# EAGLE design host_1 (EAGLE 9.3.1)
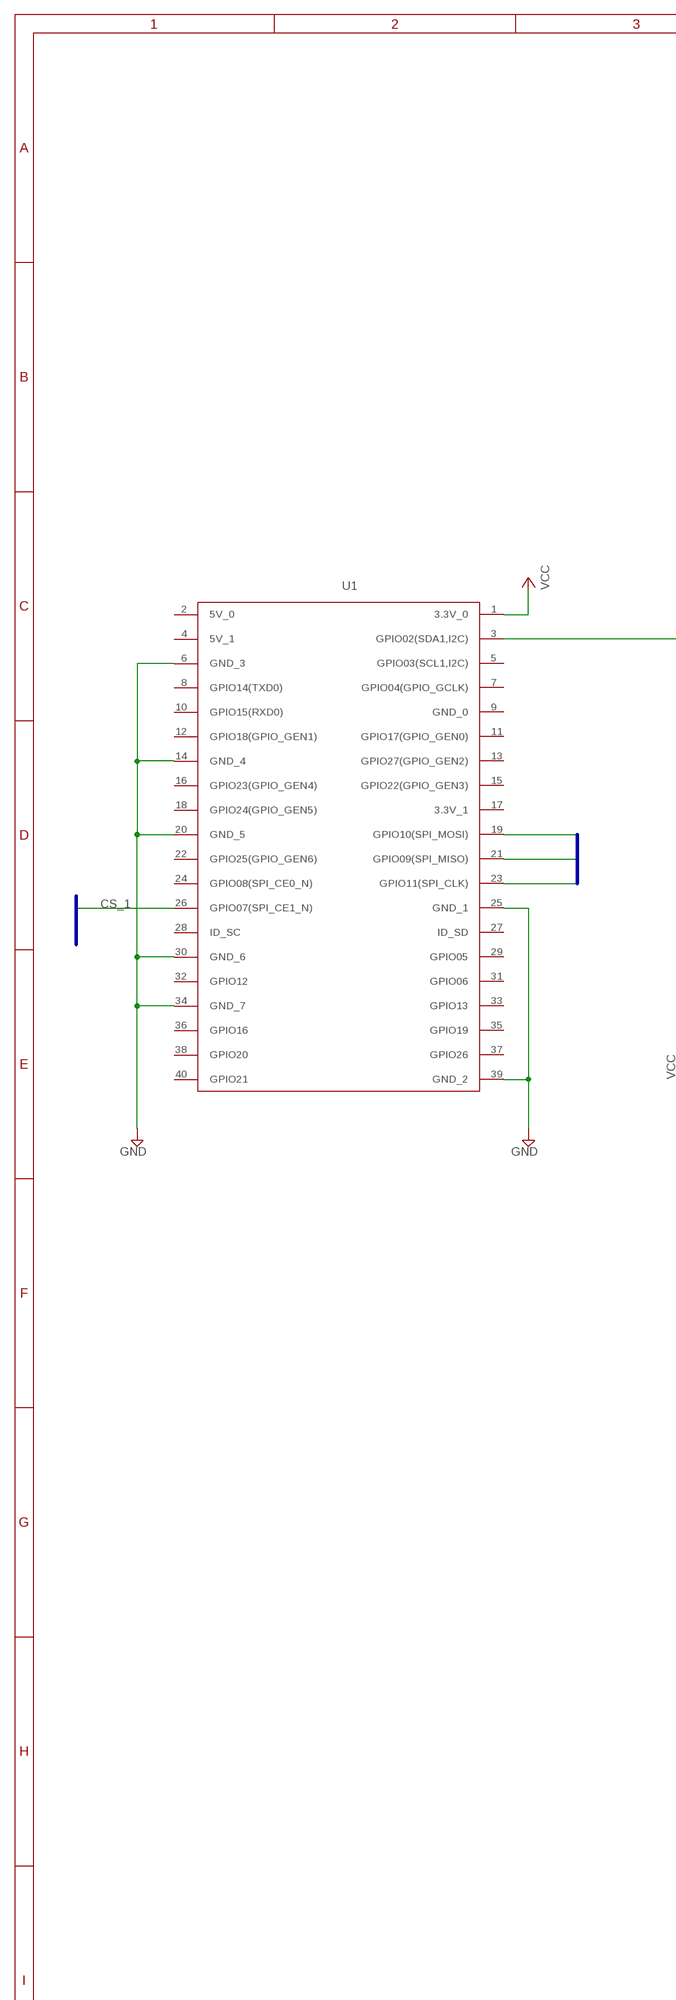
[diagram p0: schematic, sheet 1, part 1 of 2]
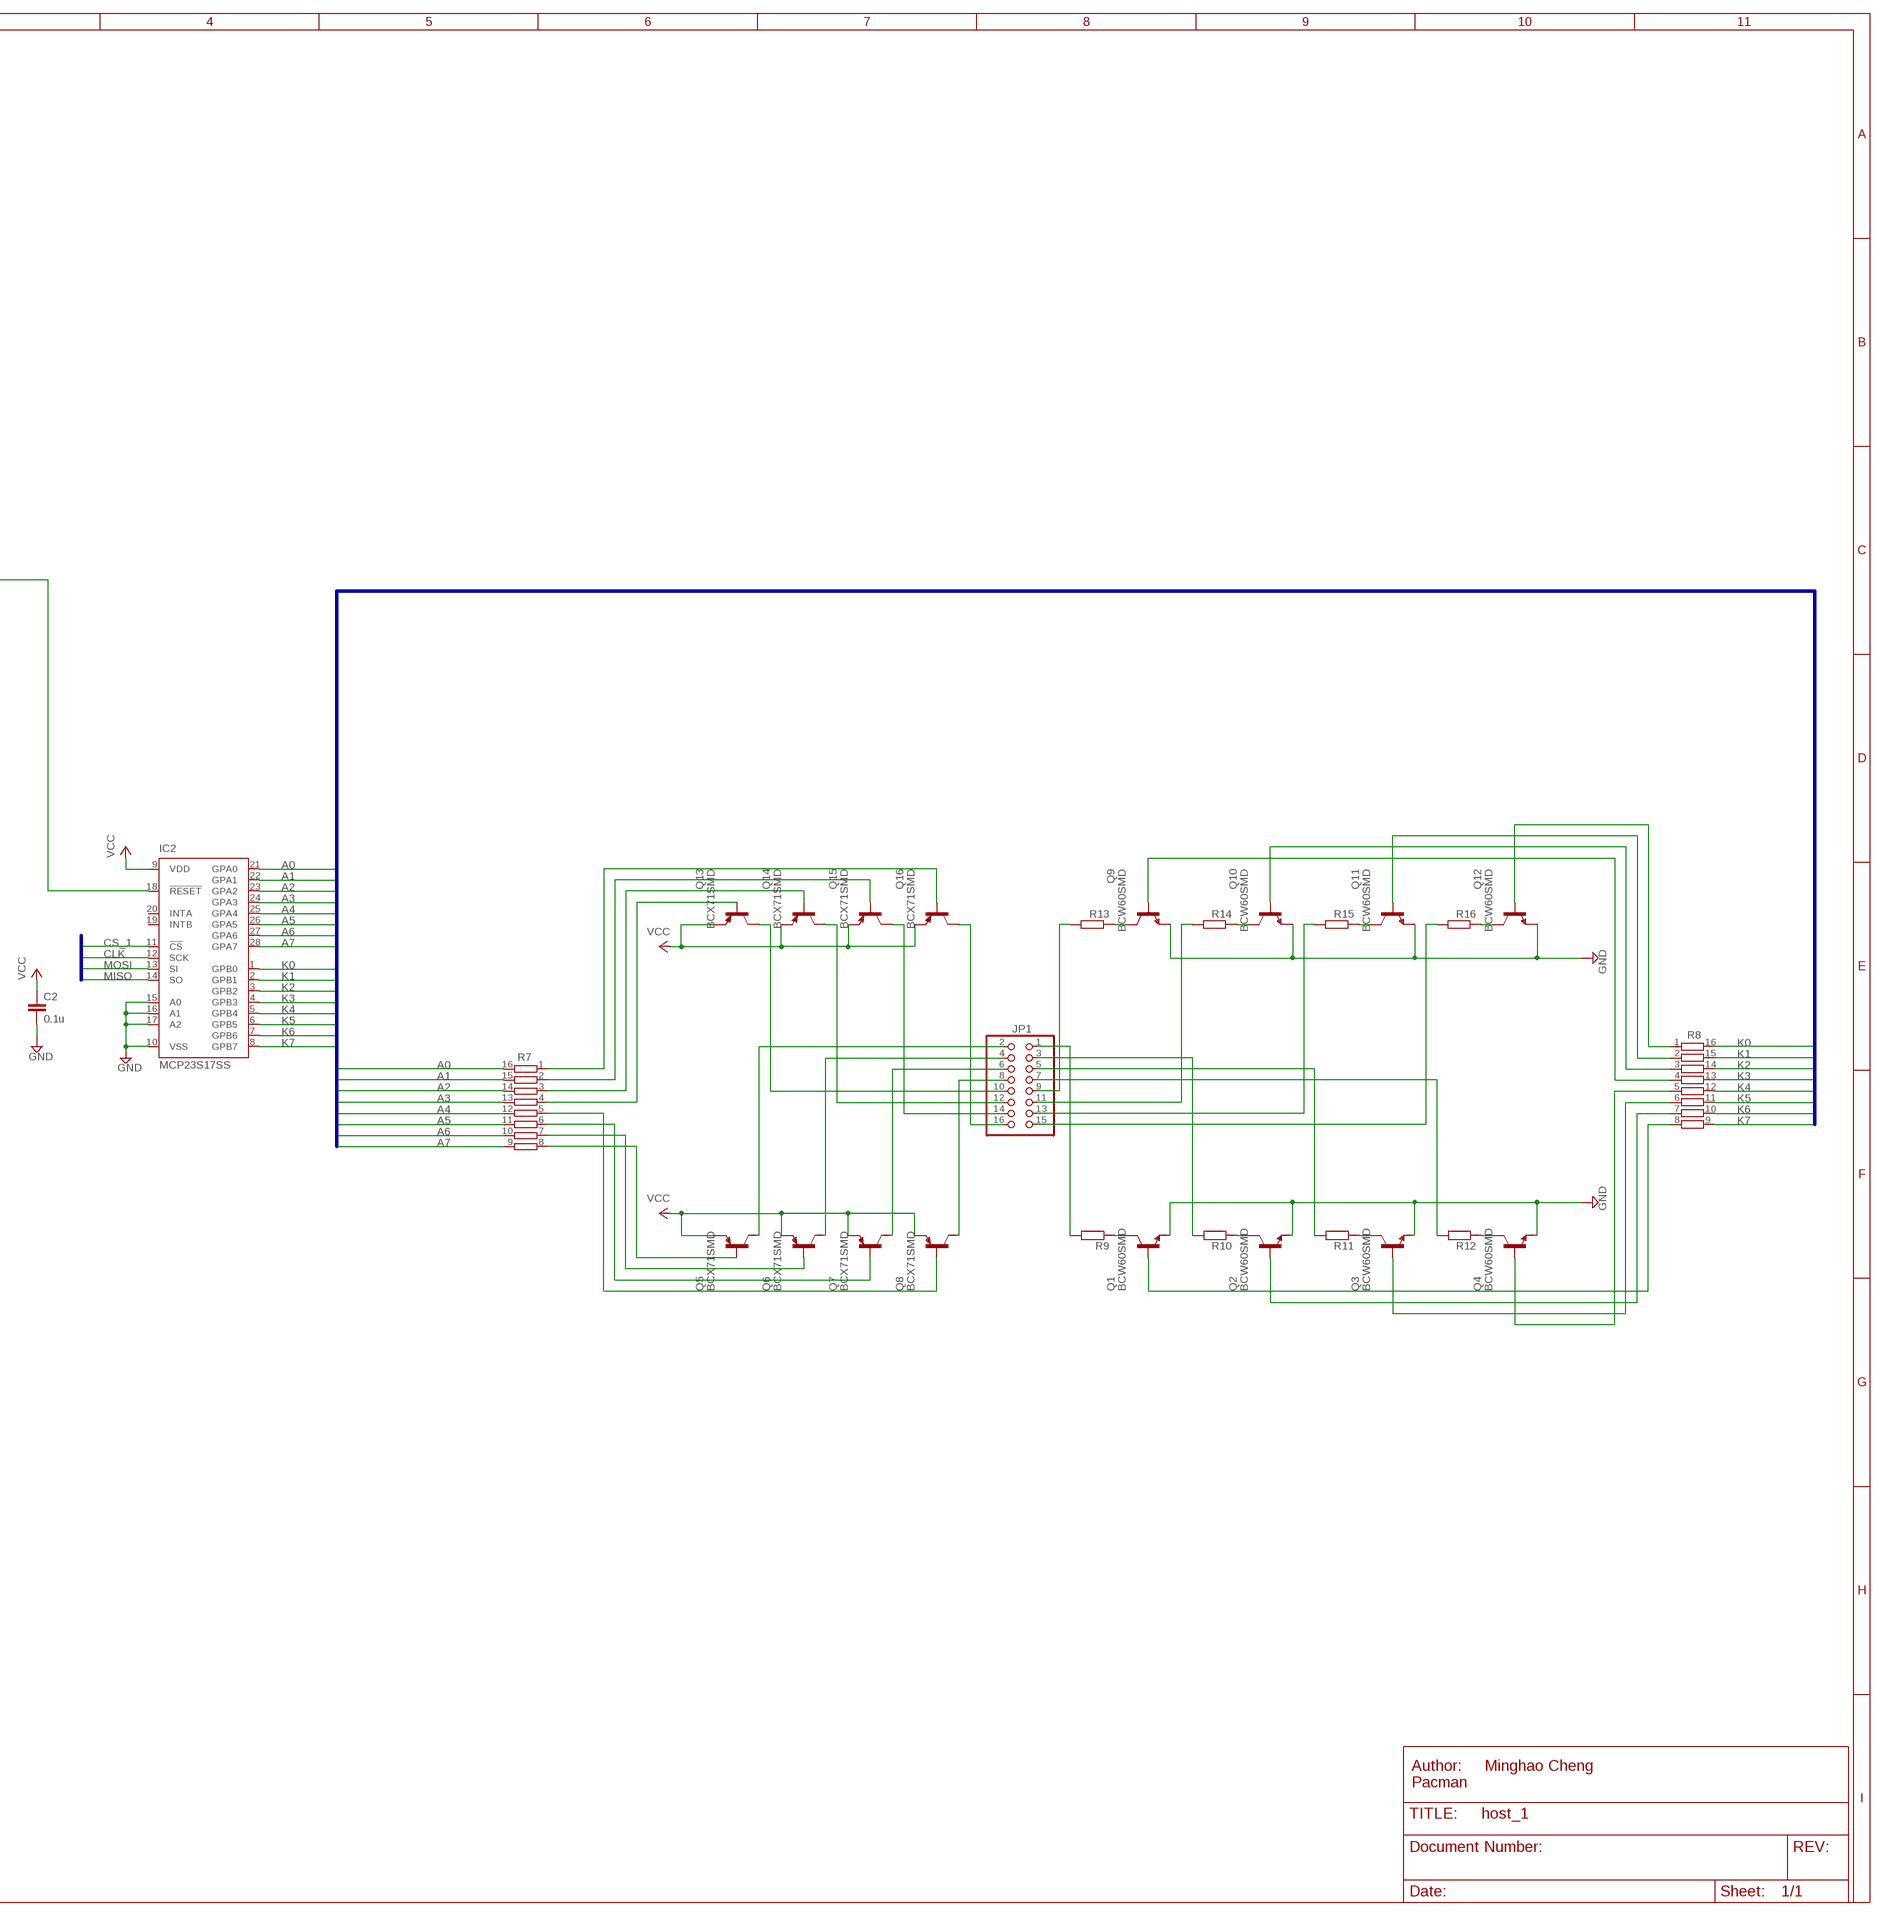
[diagram p1: schematic, sheet 1, part 2 of 2]

## Parts
C2  0.1u  C-EUC0805  [C0805]
IC2  MCP23S17SS  [SSOP28]
JP1  PINHD-2X8  [2X08]
Q1  BCW60SMD  [SOT23-BEC]
Q2  BCW60SMD  [SOT23-BEC]
Q3  BCW60SMD  [SOT23-BEC]
Q4  BCW60SMD  [SOT23-BEC]
Q5  BCX71SMD  [SOT23]
Q6  BCX71SMD  [SOT23]
Q7  BCX71SMD  [SOT23]
Q8  BCX71SMD  [SOT23]
Q9  BCW60SMD  [SOT23-BEC]
Q10  BCW60SMD  [SOT23-BEC]
Q11  BCW60SMD  [SOT23-BEC]
Q12  BCW60SMD  [SOT23-BEC]
Q13  BCX71SMD  [SOT23]
Q14  BCX71SMD  [SOT23]
Q15  BCX71SMD  [SOT23]
Q16  BCX71SMD  [SOT23]
R7  4816P-T01  [4816P]
R8  4816P-T01  [4816P]
R9  4.7K  R-EU_R0805  [R0805]
R10  4.7K  R-EU_R0805  [R0805]
R11  4.7K  R-EU_R0805  [R0805]
R12  4.7K  R-EU_R0805  [R0805]
R13  4.7K  R-EU_R0805  [R0805]
R14  4.7K  R-EU_R0805  [R0805]
R15  4.7K  R-EU_R0805  [R0805]
R16  4.7K  R-EU_R0805  [R0805]
U1  RASPI3_GPIO  [FE20-2]

## Nets
A0: IC2.21(GPA0) R7.16
A1: IC2.22(GPA1) R7.15
A2: IC2.23(GPA2) R7.14
A3: IC2.24(GPA3) R7.13
A4: IC2.25(GPA4) R7.12
A5: IC2.26(GPA5) R7.11
A6: IC2.27(GPA6) R7.10
A7: IC2.28(GPA7) R7.9
CLK: IC2.12(SCK) U1.23(GPIO11(SPI_CLK))
CS_1: IC2.11(!CS) U1.26(GPIO07(SPI_CE1_N))
GND: C2.2 IC2.10(VSS) IC2.15(A0) IC2.16(A1) IC2.17(A2) Q1.E Q2.E Q3.E Q4.E Q9.E Q10.E Q11.E Q12.E U1.6(GND_3) U1.14(GND_4) U1.20(GND_5) U1.25(GND_1) U1.30(GND_6) U1.34(GND_7) U1.39(GND_2)
K0: IC2.1(GPB0) R8.16
K1: IC2.2(GPB1) R8.15
K2: IC2.3(GPB2) R8.14
K3: IC2.4(GPB3) R8.13
K4: IC2.5(GPB4) R8.12
K5: IC2.6(GPB5) R8.11
K6: IC2.7(GPB6) R8.10
K7: IC2.8(GPB7) R8.9
MISO: IC2.14(SO) U1.21(GPIO09(SPI_MISO))
MOSI: IC2.13(SI) U1.19(GPIO10(SPI_MOSI))
N$1: IC2.18(!RESET) U1.3(GPIO02(SDA1,I2C))
N$2: JP1.1 R9.2
N$3: JP1.3 R10.2
N$4: JP1.5 R11.2
N$5: Q5.1(B) R7.8
N$6: JP1.7 R12.2
N$7: JP1.9 R13.2
N$8: JP1.11 R14.2
N$9: JP1.13 R15.2
N$10: JP1.15 R16.2
N$11: JP1.2 Q5.3(C)
N$12: JP1.4 Q6.3(C)
N$13: JP1.6 Q7.3(C)
N$14: JP1.8 Q8.3(C)
N$15: JP1.10 Q13.3(C)
N$16: Q1.B R8.8
N$17: Q2.B R8.7
N$18: Q3.B R8.6
N$19: Q4.B R8.5
N$20: Q9.B R8.4
N$21: Q10.B R8.3
N$22: Q11.B R8.2
N$23: Q6.1(B) R7.7
N$24: Q7.1(B) R7.6
N$25: Q8.1(B) R7.5
N$27: JP1.12 Q14.3(C)
N$28: JP1.14 Q15.3(C)
N$29: JP1.16 Q16.3(C)
N$31: Q12.B R8.1
N$34: Q1.C R9.1
N$36: Q2.C R10.1
N$37: Q3.C R11.1
N$38: Q4.C R12.1
N$39: Q13.1(B) R7.4
N$40: Q14.1(B) R7.3
N$41: Q15.1(B) R7.2
N$42: Q16.1(B) R7.1
N$63: Q9.C R13.1
N$64: Q10.C R14.1
N$65: Q11.C R15.1
N$66: Q12.C R16.1
VCC: C2.1 IC2.9(VDD) Q5.2(E) Q6.2(E) Q7.2(E) Q8.2(E) Q13.2(E) Q14.2(E) Q15.2(E) Q16.2(E) U1.1(3.3V_0)
Unconnected: IC2.19(INTB) IC2.20(INTA) U1.2(5V_0) U1.4(5V_1) U1.5(GPIO03(SCL1,I2C)) U1.7(GPIO04(GPIO_GCLK)) U1.8(GPIO14(TXD0)) U1.9(GND_0) U1.10(GPIO15(RXD0)) U1.11(GPIO17(GPIO_GEN0)) U1.12(GPIO18(GPIO_GEN1)) U1.13(GPIO27(GPIO_GEN2)) U1.15(GPIO22(GPIO_GEN3)) U1.16(GPIO23(GPIO_GEN4)) U1.17(3.3V_1) U1.18(GPIO24(GPIO_GEN5)) U1.22(GPIO25(GPIO_GEN6)) U1.24(GPIO08(SPI_CE0_N)) U1.27(ID_SD) U1.28(ID_SC) U1.29(GPIO05) U1.31(GPIO06) U1.32(GPIO12) U1.33(GPIO13) U1.35(GPIO19) U1.36(GPIO16) U1.37(GPIO26) U1.38(GPIO20) U1.40(GPIO21)

## Buses
SPI_PI:CLK,CS_0,CS_1,MISO,MOSI
LED_MATRIX:A[0..7],K[0..7]

## Notes on the sheet
- Author:     Minghao Cheng
  Pacman

## Library data of the parts
C2 = rcl:C-EU: CAPACITOR, European symbol; SPICEPREFIX: C
IC2 = microchip:MCP23S17: http://ww1.microchip.com/downloads/en/DeviceDoc/21952a.pdf Source: http://ww1.microchip.com/downloads/en/DeviceDoc/21952a.pdf; MF: MICROCHIP; MPN: MCP23S17-E/SS; OC_FARNELL: 1467675; OC_NEWARK: 31K2952
JP1 = pinhead:PINHD-2X8: PIN HEADER
Q1-Q4 Q9-Q12 = transistor-npn:BCW60*: NPN Transistor
Q5-Q8 Q13-Q16 = transistor-pnp:BCX71SMD: PNP Transistor
R7 R8 = resistor-bourns:4816P-T01: BOURNS RESISTOR NETWORK; MF: BOURNS, INC.; MPN: 4816P-T01-684LF; OC_FARNELL: 9357483; OC_NEWARK: 33K0707
R9-R16 = rcl:R-EU_: RESISTOR, European symbol; SPICEPREFIX: R
U1 = PacMan:RASPI3_GPIO

## Net classes
0 default: width 0.305 mm, drill 0.508 mm, clearance 0.254 mm

## Board
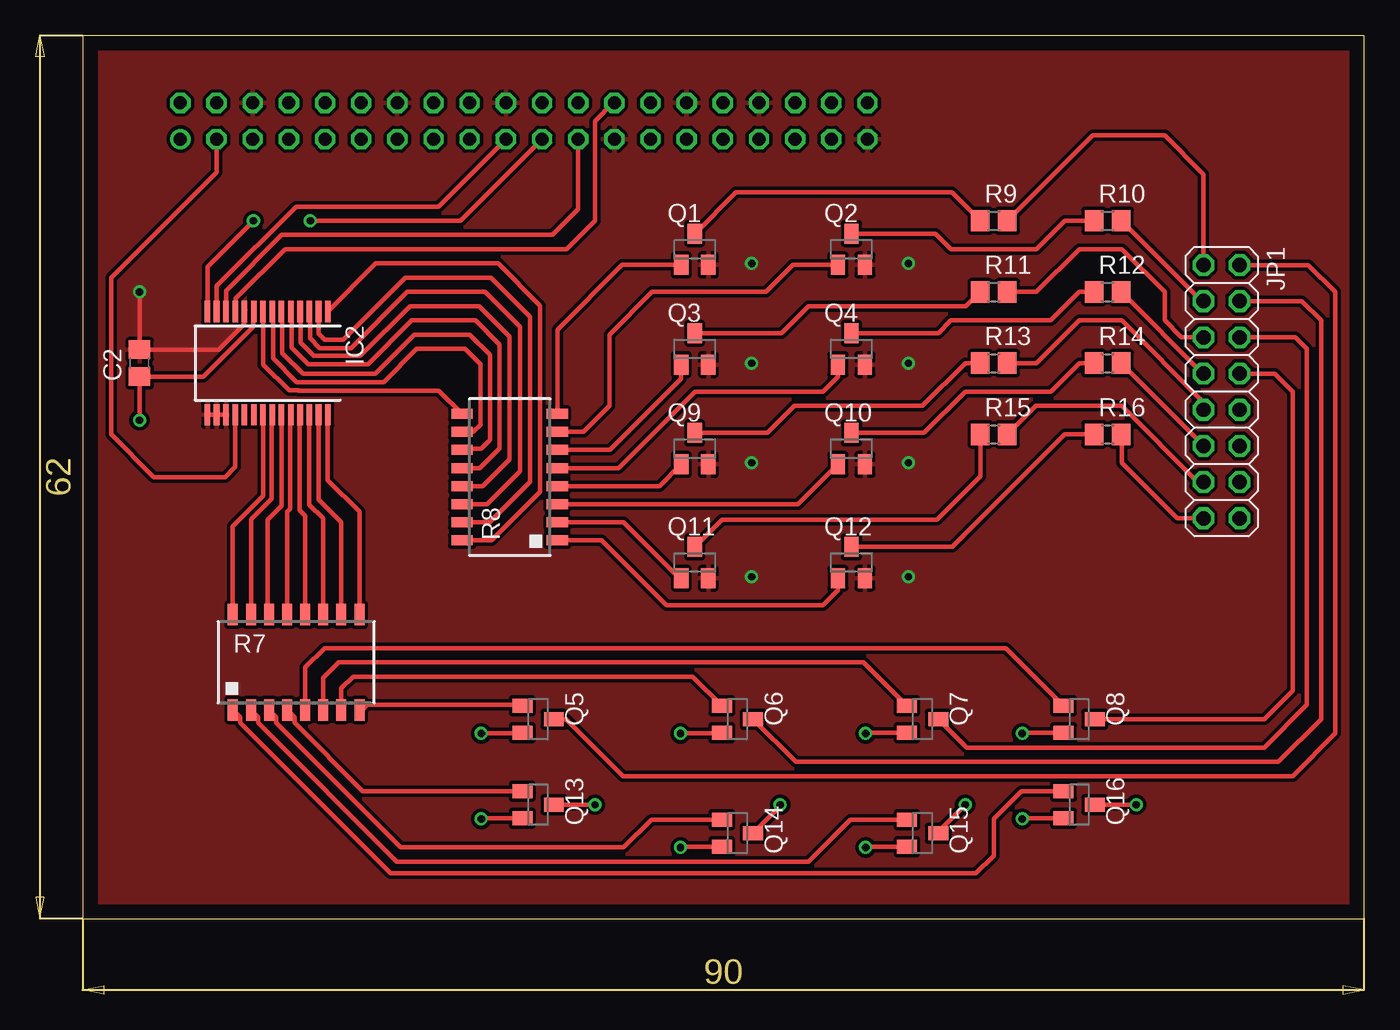
[diagram p2: board, top side]
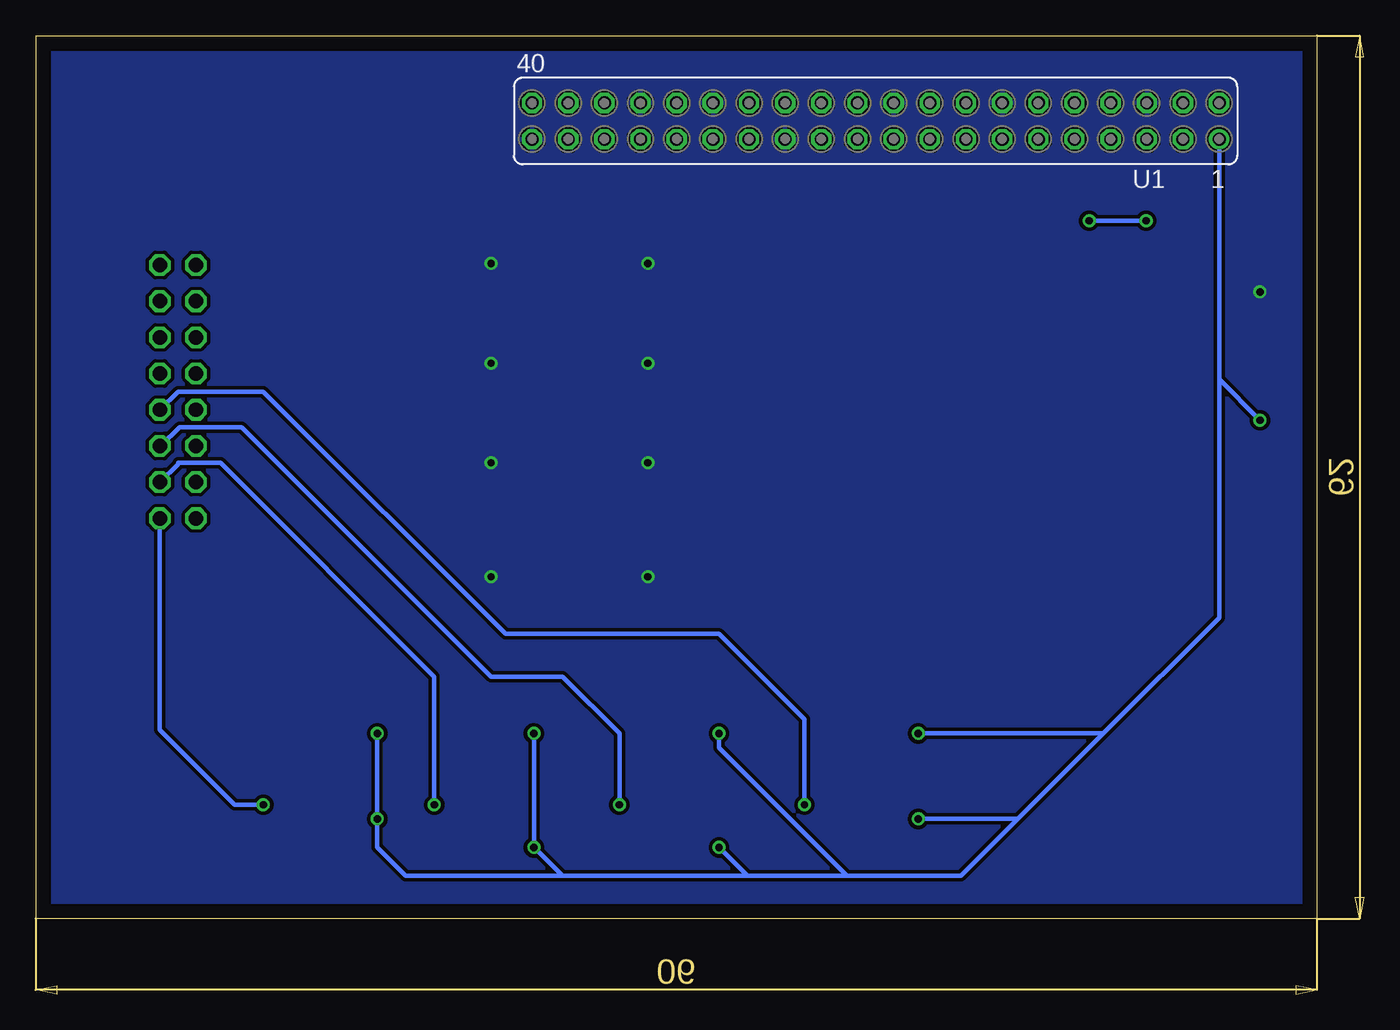
[diagram p3: board, bottom side, seen from below]

Size 90 x 62 mm. Coordinates in mm from the lower left corner, seen from the top.
Outline: 0,0 90,0 90,62 0,62 0,2 0,0
Copper layers (1*16): Top 0.035mm / dielectric 1.5mm / Bottom 0.035mm
Design rules "default": minimum track width 6mil, minimum drill 0.35mm, track to track 6mil, track to pad 6mil, pad to pad 6mil, via to via 6mil, smd to smd 6mil, copper to edge 40mil, drill to drill 6mil, minimum pad ring 10mil, minimum via ring 8mil, stop-mask expansion 4mil, vias tented up to drill 0mil, thermal gap 10mil

### Footprints (pad centres in the part's own frame; a part is rotated, then mirrored left to right if it is on the bottom)
C0805 = smd 1.3 x 1.5: 1 -0.95,0; 2 0.95,0
SSOP28 = smd 0.4 x 1.5: 1 -4.225,-3.625; 2 -3.575,-3.625; 3 -2.925,-3.625; 4 -2.275,-3.625; 5 -1.625,-3.625; 6 -0.975,-3.625; 7 -0.325,-3.625; 8 0.325,-3.625; 9 0.975,-3.625; 10 1.625,-3.625; 11 2.275,-3.625; 12 2.925,-3.625; 13 3.575,-3.625; 14 4.225,-3.625; 15 4.225,3.625; 16 3.575,3.625; 17 2.925,3.625; 18 2.275,3.625; 19 1.625,3.625; 20 0.975,3.625; 21 0.325,3.625; 22 -0.325,3.625; 23 -0.975,3.625; 24 -1.625,3.625; 25 -2.275,3.625; 26 -2.925,3.625; 27 -3.575,3.625; 28 -4.225,3.625
2X08 = drill 1.016 octagon: 1 -8.89,-1.27; 2 -8.89,1.27; 3 -6.35,-1.27; 4 -6.35,1.27; 5 -3.81,-1.27; 6 -3.81,1.27; 7 -1.27,-1.27; 8 -1.27,1.27; 9 1.27,-1.27; 10 1.27,1.27; 11 3.81,-1.27; 12 3.81,1.27; 13 6.35,-1.27; 14 6.35,1.27; 15 8.89,-1.27; 16 8.89,1.27
SOT23-BEC = smd 1 x 1.4: B -0.95,-1.1; C 0,1.1; E 0.95,-1.1
SOT23 = smd 1 x 1.4: 1 -0.95,-1.1; 2 0.95,-1.1; 3 0,1.1
4816P = smd 0.7 x 1.5: 1 -4.445,-3.346; 2 -3.175,-3.346; 3 -1.905,-3.346; 4 -0.635,-3.346; 5 0.635,-3.346; 6 1.905,-3.346; 7 3.175,-3.346; 8 4.445,-3.346; 9 4.445,3.346; 10 3.175,3.346; 11 1.905,3.346; 12 0.635,3.346; 13 -0.635,3.346; 14 -1.905,3.346; 15 -3.175,3.346; 16 -4.445,3.346
R0805 = smd 1.3 x 1.5: 1 -0.95,0; 2 0.95,0
FE20-2 = drill 0.914: 1 -24.13,1.27 | drill 0.914 octagon: 2 -24.13,-1.27; 3 -21.59,1.27; 4 -21.59,-1.27; 5 -19.05,1.27; 6 -19.05,-1.27; 7 -16.51,1.27; 8 -16.51,-1.27; 9 -13.97,1.27; 10 -13.97,-1.27; 11 -11.43,1.27; 12 -11.43,-1.27; 13 -8.89,1.27; 14 -8.89,-1.27; 15 -6.35,1.27; 16 -6.35,-1.27; 17 -3.81,1.27; 18 -3.81,-1.27; 19 -1.27,1.27; 20 -1.27,-1.27; 21 1.27,1.27; 22 1.27,-1.27; 23 3.81,1.27; 24 3.81,-1.27; 25 6.35,1.27; 26 6.35,-1.27; 27 8.89,1.27; 28 8.89,-1.27; 29 11.43,1.27; 30 11.43,-1.27; 31 13.97,1.27; 32 13.97,-1.27; 33 16.51,1.27; 34 16.51,-1.27; 35 19.05,1.27; 36 19.05,-1.27; 37 21.59,1.27; 38 21.59,-1.27; 39 24.13,1.27; 40 24.13,-1.27

### Placement (x,y rotation side)
C2  4,39 90 top
IC2  13,39 180 top
JP1  80,37 270 top
Q1  43,47 0 top
Q2  54,47 0 top
Q3  43,40 0 top
Q4  54,40 0 top
Q5  32,14 270 top
Q6  46,14 270 top
Q7  59,14 270 top
Q8  70,14 270 top
Q9  43,33 0 top
Q10  54,33 0 top
Q11  43,25 0 top
Q12  54,25 0 top
Q13  32,8 270 top
Q14  46,6 270 top
Q15  59,6 270 top
Q16  70,8 270 top
R7  15,18 0 top
R8  30,31 90 top
R9  64,49 0 top
R10  72,49 0 top
R11  64,44 0 top
R12  72,44 0 top
R13  64,39 0 top
R14  72,39 0 top
R15  64,34 0 top
R16  72,34 0 top
U1  31,56 180 bottom

### Tracks (layer width: path | path; a pad name or v marks a point on that pad's centre or on a via)
A0
  Top 0.305: IC2.21 12.68,29.68 10.55,27.55 R7.16
A1
  Top 0.305: IC2.22 13.28,35.33 13.28,29.49 11.82,28.04 R7.15
A2
  Top 0.305: IC2.23 13.97,28.98 13,28 13,21.44 R7.14
A3
  Top 0.305: R7.13 14.37,28.57 14.58,28.79 14.58,35.33 IC2.24
A4
  Top 0.305: R7.12 15.63,28.27 15.24,28.67 15.24,35.34 IC2.25
A5
  Top 0.305: R7.11 16.91,28.09 15.93,29.07 IC2.26
A6
  Top 0.305: IC2.27 16.57,29.43 18.18,27.82 R7.10
A7
  Top 0.305: R7.9 19.45,28.55 17.23,30.77 IC2.28
CLK
  Top 0.305: IC2.12 10.07,44.08 14,48 33,48 34.81,49.81 U1.23
CS_1
  Top 0.305: IC2.11 10.77,42.67 10.77,43.54 14.22,47 34,47 36,49 36,56 37.27,57.27 U1.26
GND  (via drill 0.51)
  Top 0.305: IC2.10 11.33,42.58 11.33,41.71 9.57,39.95 C2.2 v4,44 | 42.43,57.43 U1.30 | IC2.17 IC2.15 | Q12.E 55.05,24 | Q3.E 44.05,39 | Q4.E 55.05,39
  other vias: 47,39 47,32 47,24 58,39 58,32 58,24 47,46 58,46
  pour Top: 1,61 1,1 89,1 89,61
  pour Bottom: 1,61 1,1 89,1 89,61
K0
  Top 0.305: IC2.1 20.6,46 29.17,46 32.13,43.04 32.13,29.97 28.71,26.55 R8.16
K1
  Top 0.305: R8.15 28.59,27.82 31.44,30.68 31.44,42.26 28.7,45 22.65,45 18.29,40.64 17.02,40.64 16.57,41.08 IC2.2
K2
  Top 0.305: IC2.3 15.97,42.58 15.97,40.76 16.66,40.06 18.86,40.06 22.79,44 28.29,44 30.73,41.56 30.73,31.4 28.43,29.09 R8.14
K3
  Top 0.305: IC2.4 15.32,42.58 15.32,40.43 16.25,39.51 19.51,39.51 23,43 27.85,43 29.99,40.87 29.99,32.27 28.08,30.36 R8.13
K4
  Top 0.305: IC2.5 14.67,42.58 14.67,40.09 15.83,38.93 20.05,38.93 23.12,42 27.59,42 29.28,40.3 29.28,33.04 27.88,31.64 R8.12
K5
  Top 0.305: IC2.6 14.02,42.58 14.02,39.71 15.48,38.25 20.54,38.25 23.29,41 27.2,41 28.61,39.59 28.61,33.61 28,33 26.75,33 R8.11
K6
  Top 0.305: R8.10 27.44,34.17 27.96,34.69 27.96,38.91 26.87,40 23.46,40 21.13,37.67 15.03,37.67 13.37,39.34 13.37,42.58 IC2.7
K7
  Top 0.305: IC2.8 12.68,38.9 14.49,37.08 15.18,37.08 25.02,37.08 R8.9
MISO  (via drill 0.51)
  Top 0.305: U1.21 26.54,49 v16,49 | IC2.14 8.78,45.77 v12,49
  Bottom 0.305: v12,49 v16,49
MOSI
  Top 0.305: IC2.13 9.43,44.42 15,50 25,50 U1.19
N$1
  Top 0.305: IC2.18 10.72,31.73 10,31 5,31 2,34 2,45 9.41,52.41 U1.3
N$2
  Top 0.305: R9.2 70.95,55 76,55 78.73,52.27 JP1.1
N$3
  Top 0.305: R10.2 78.6,43.35 JP1.3
N$4
  Top 0.305: R11.2 67,44 70,47 73,47 76,44 76,42 77.19,40.81 JP1.5
N$5
  Top 0.305: R7.8 19.65,14.65 20,15 30.85,15 Q5.1
N$6
  Top 0.305: R12.2 78.68,38.27 JP1.7
N$7
  Top 0.305: R13.2 67,39 70,42 73,42 78.73,36.27 JP1.9
N$8
  Top 0.305: R14.2 78.73,33.22 JP1.11
N$9
  Top 0.305: R15.2 66.95,36 73,36 78.35,30.65 JP1.13
N$10
  Top 0.305: R16.2 73,33.95 73,32 76.89,28.11 JP1.15
N$11
  Top 0.305: JP1.2 86.11,45.89 88,44 88,13 85,10 37.95,10 33.95,14 Q5.3
N$12
  Top 0.305: JP1.4 85.65,43.35 87,42 87,14 84,11 50.1,11 Q6.3
N$13
  Top 0.305: JP1.6 85.19,40.81 86,40 86,15 83,12 62.1,12 Q7.3
N$14
  Top 0.305: Q8.3 83,14 85,16 85,37 83.73,38.27 JP1.8
N$15  (via drill 0.51)
  Top 0.305: Q13.3 v36,8
  Bottom 0.305: JP1.10 80,37 74,37 57,20 42,20 36,14 v36,8
N$16
  Top 0.305: R8.8 33.35,41.35 37.9,45.9 Q1.B
N$17
  Top 0.305: R8.7 35.17,34.17 37,36 37,41 40,44 48,44 49.9,45.9 Q2.B
N$18
  Top 0.305: R8.6 37.05,32.91 42.05,37.9 Q3.B
N$19
  Top 0.305: R8.5 37.63,31.64 43,37 52,37 53.05,38.05 Q4.B
N$20
  Top 0.305: R8.4 40.52,30.36 Q9.B
N$21
  Top 0.305: R8.3 50.24,29.09 Q10.B
N$22
  Top 0.305: R8.2 38,27.82 41.92,23.9 Q11.B
N$23
  Top 0.305: R7.7 18.18,16.18 19,17 36,17 42.85,17 Q6.1
N$24
  Top 0.305: R7.6 16.91,16.91 18,18 54.85,18 Q7.1
N$25
  Top 0.305: R7.5 15.63,17.64 17,19 64.85,19 Q8.1
N$27  (via drill 0.51)
  Top 0.305: Q14.3 49,7.9 v49,8
  Bottom 0.305: JP1.12 81.2,33.19 79.88,34.51 75.51,34.51 58,17 53,17 49,13 v49,8
N$28  (via drill 0.51)
  Top 0.305: v62,8 60.1,6.1 Q15.3
  Bottom 0.305: v62,8 62,17 77,32 80,32 80,31.92 JP1.14
N$29  (via drill 0.51)
  Top 0.305: Q16.3 v74,8
  Bottom 0.305: v74,8 76,8 81.27,13.27 JP1.16
N$31
  Top 0.305: R8.1 36.45,26.55 41,22 52,22 53.05,23.05 Q12.B
N$34
  Top 0.305: Q1.C 45.9,51 61.05,51 R9.1
N$36
  Top 0.305: Q2.C 59.9,48.1 61,47 67,47 69,49 R10.1
N$37
  Top 0.305: Q3.C 49.1,41.1 51,43 62.05,43 R11.1
N$38
  Top 0.305: R12.1 70,44 68,42 61,42 60.1,41.1 Q4.C
N$39
  Top 0.305: R7.4 14.88,14.14 14.88,13.74 19.66,8.95 Q13.1
N$40
  Top 0.305: R7.3 13.61,14.14 13.61,13.74 22.34,5 38,5 39.95,6.95 Q14.1
N$41
  Top 0.305: R7.2 12.34,14.14 12.34,13.74 22.07,4 51,4 53.95,6.95 Q15.1
N$42
  Top 0.305: R7.1 11.07,14.14 11.07,13.74 21.64,3.17 62.76,3.17 64,4.41 64,7 65.95,8.95 Q16.1
N$63
  Top 0.305: Q9.C 48.1,34.1 50,36 59,36 62,39 R13.1
N$64
  Top 0.305: R14.1 70,39 68,37 62,37 59.1,34.1 Q10.C
N$65
  Top 0.305: R15.1 63.05,31.05 60,28 44.9,28 Q11.C
N$66
  Top 0.305: R16.1 69,34 61.1,26.1 Q12.C
VCC  (via drill 0.51)
  Top 0.305: IC2.9 11.98,42.58 11.98,41.57 8.46,38.05 C2.1 v4,35 | v28,7 28.05,7.05 Q13.2 | v42,5 42.05,5.05 Q14.2 | v66,7 66.05,7.05 Q16.2 | v55,5 55.05,5.05 Q15.2 | Q7.2 55.05,13.05 v55,13 | Q8.2 66.05,13.05 v66,13 | Q5.2 30.85,13 v28,13 | Q6.2 44.85,13 v42,13
  Bottom 0.305: 21,7 25,3 33,3 | 21,7 15,13 | 40,3 33,3 | v42,13 42,12 33,3 | v28,13 15,13 | v28,7 21,7 | v42,5 40,3 | 40,3 53,3 | 53,3 64,3 66,5 v66,7 v66,13 | 53,3 v55,5 v55,13 | U1.1 6.87,37.87 | 6.87,37.87 6.87,21.13 15,13 | v4,35 6.87,37.87